# Altium schematic sheet block diagram.SchDoc: Block Diagram
size A4; Revision: 1.0; SheetNumber: 1; SheetTotal: 10
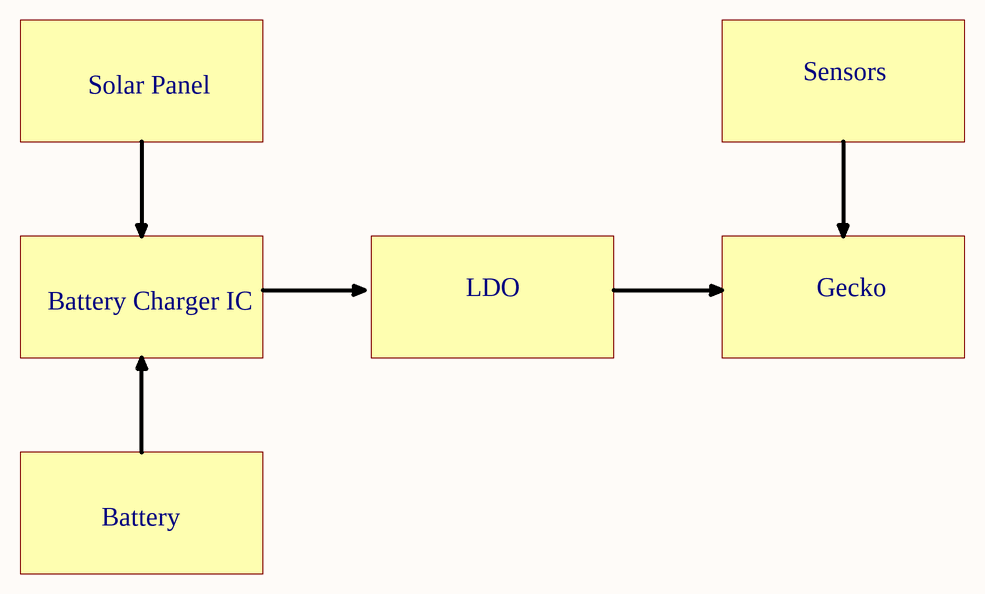
[diagram p0: block diagram.SchDoc]

## Notes on the sheet
- Sensors
- Solar Panel
- Battery Charger IC
- LDO
- Gecko
- Battery
- Title
- Size:
- Date:
- A4
- Number:
- Time:
- Revision:
- Sheet
- of
- File: